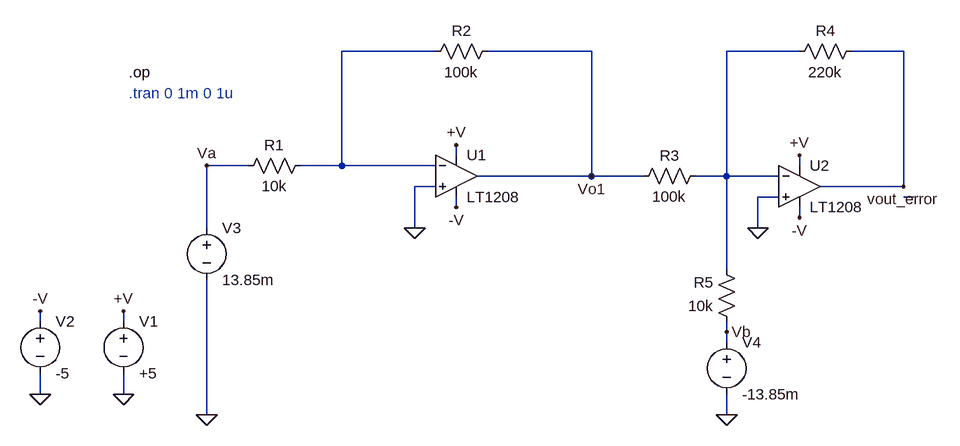
[diagram p0: schematic ETAJ 1 OP.asc]
ETAJ 1 OP.asc, the LTspice schematic file:
Version 4
SHEET 1 1040 680
WIRE 240 -80 96 -80
WIRE 480 -80 320 -80
WIRE 800 -80 688 -80
WIRE 960 -80 880 -80
WIRE 272 80 272 64
WIRE -48 96 -112 96
WIRE 96 96 96 -80
WIRE 96 96 32 96
WIRE 240 96 96 96
WIRE 800 96 800 80
WIRE 480 112 480 -80
WIRE 480 112 304 112
WIRE 560 112 480 112
WIRE 688 112 688 -80
WIRE 688 112 640 112
WIRE 768 112 688 112
WIRE 240 128 208 128
WIRE 960 128 960 -80
WIRE 960 128 832 128
WIRE 768 144 736 144
WIRE 976 144 960 144
WIRE 272 160 272 144
WIRE 800 176 800 160
WIRE -112 192 -112 96
WIRE 208 192 208 128
WIRE 736 192 736 144
WIRE 688 256 688 112
WIRE -368 336 -368 320
WIRE -240 336 -240 320
WIRE 688 352 688 336
WIRE 688 368 688 352
WIRE -368 448 -368 416
WIRE -240 448 -240 416
WIRE -112 480 -112 272
WIRE 688 480 688 448
FLAG -240 448 0
FLAG 272 64 +V
FLAG -240 320 +V
FLAG 272 160 -V
FLAG -368 448 0
FLAG -368 320 -V
FLAG 800 80 +V
FLAG 800 176 -V
FLAG 208 192 0
FLAG 736 192 0
FLAG 480 112 Vo1
FLAG -112 96 Va
FLAG -112 480 0
FLAG 688 480 0
FLAG 688 352 Vb
FLAG 960 128 vout_error
DATAFLAG 96 64 ""
DATAFLAG 736 160 ""
DATAFLAG 704 112 ""
DATAFLAG 928 128 ""
DATAFLAG 208 144 ""
SYMBOL voltage -240 320 R0
WINDOW 123 0 0 Left 2
WINDOW 39 0 0 Left 2
SYMATTR InstName V1
SYMATTR Value +5
SYMBOL voltage -368 320 R0
WINDOW 123 0 0 Left 2
WINDOW 39 0 0 Left 2
SYMATTR InstName V2
SYMATTR Value -5
SYMBOL res 48 80 R90
WINDOW 0 0 56 VBottom 2
WINDOW 3 32 56 VTop 2
SYMATTR InstName R1
SYMATTR Value 10k
SYMBOL res 336 -96 R90
WINDOW 0 0 56 VBottom 2
WINDOW 3 32 56 VTop 2
SYMATTR InstName R2
SYMATTR Value 100k
SYMBOL res 656 96 R90
WINDOW 0 0 56 VBottom 2
WINDOW 3 32 56 VTop 2
SYMATTR InstName R3
SYMATTR Value 100k
SYMBOL res 896 -96 R90
WINDOW 0 0 56 VBottom 2
WINDOW 3 32 56 VTop 2
SYMATTR InstName R4
SYMATTR Value 220k
SYMBOL res 704 352 R180
WINDOW 0 36 76 Left 2
WINDOW 3 36 40 Left 2
SYMATTR InstName R5
SYMATTR Value 10k
SYMBOL OpAmps\\LT1208 272 48 R0
SYMATTR InstName U1
SYMBOL OpAmps\\LT1208 800 64 R0
SYMATTR InstName U2
SYMBOL voltage -112 176 R0
WINDOW 123 0 0 Left 0
WINDOW 39 0 0 Left 0
SYMATTR InstName V3
SYMATTR Value 13.85m
SYMBOL voltage 688 352 R0
WINDOW 123 0 0 Left 0
WINDOW 39 0 0 Left 0
SYMATTR InstName V4
SYMATTR Value -13.85m
TEXT -232 -48 Left 2 !.op
TEXT -232 -16 Left 2 ;.tran 0 1m 0 1u

The netlist it stands for:
* ETAJ 1 OP.asc
V1 +V 0 +5
V2 -V 0 -5
R1 N001 Va 10k
R2 Vo1 N001 100k
R3 N002 Vo1 100k
R4 vout_error N002 220k
R5 Vb N002 10k
XU1 0 N001 +V -V Vo1 LT1208  ; pins In+ In- V+ V- OUT
XU2 0 N002 +V -V vout_error LT1208  ; pins In+ In- V+ V- OUT
V3 Va 0 13.85m
V4 Vb 0 -13.85m
.op
* .tran 0 1m 0 1u
.backanno
.end